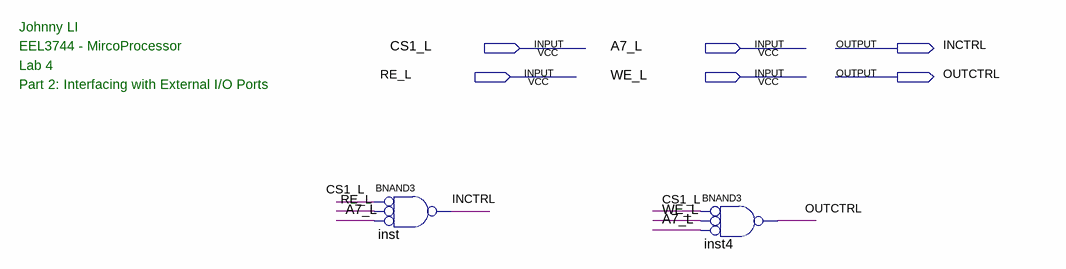
[diagram p0: schematic sheet]
// Quartus schematic lab4_2.bdf as structural Verilog: 2 symbols, 6 pins
module lab4_2 (
  input  CS1_L,
  input  A7_L,
  input  RE_L,
  input  WE_L,
  output INCTRL,
  output OUTCTRL
);

  nand inst (INCTRL, ~CS1_L, ~RE_L, ~A7_L);  // BNAND3
  nand inst4 (OUTCTRL, ~CS1_L, ~WE_L, ~A7_L);  // BNAND3

  // Notes on the sheet:
  //   Johnny LI
  //   EEL3744 - MircoProcessor
  //   Lab 4
  //   Part 2: Interfacing with External I/O Ports
endmodule
